# Altium schematic sheet Sch_pwr_brd_pwr.SchDoc
size A
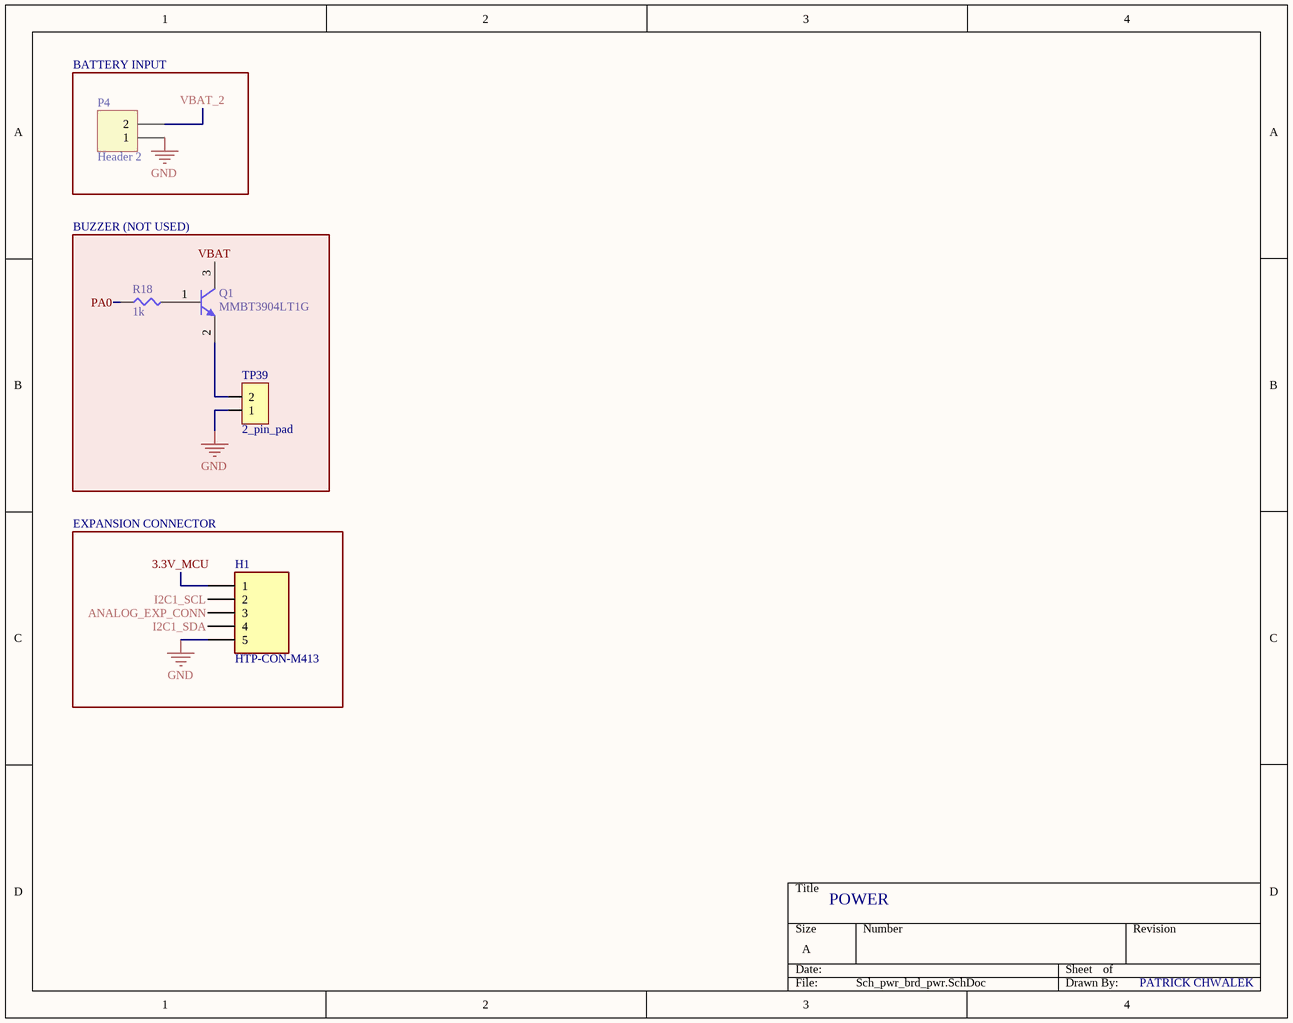
[diagram p0: Sch_pwr_brd_pwr.SchDoc]

## Parts
H1  HTP-CON-M413  [HTP-CON-M413]
P4  Header 2  [HDR1X2]
Q1  MMBT3904LT1G  [ONSC-SOT-23-3-318-08_V]
R18  1k  [SMD-0402-RES]
TP39  2_pin_pad  [Edge Connector (2-mini)]

## Blocks framed on the sheet
BATTERY INPUT: P4
BUZZER (NOT USED): Q1 R18 TP39
EXPANSION CONNECTOR: H1

## Nets
GND: H1.5 P4.1 TP39.1
3.3V_MCU: H1.1
ANALOG_EXP_CONN: H1.3
I2C1_SCL: H1.2
I2C1_SDA: H1.4
PA0: R18.1
VBAT: Q1.3(C)
VBAT_2: P4.2
NetQ1_1: Q1.1(B) R18.2
NetQ1_2: Q1.2(E) TP39.2

## Notes on the sheet
- POWER
- PATRICK CHWALEK

## Library data of the parts
P4 = Header 2: Header, 2-Pin; LatestRevisionDate: 17-Jul-2002; LatestRevisionNote: Re-released for DXP Platform.; Publisher: Altium Limited
Q1 = CMP-1048-00631-1: General Purpose Transistor, NPN Silicon, 3-Pin SOT-23, Pb-Free, Tape and Reel; Manufacturer: On Semiconductor; IC Continuous (A): 0.2; fT Min (MHz): 300; ComponentLink2Description: Datasheet; Polarity: NPN; PackageDescription: 3-Pin Small Outline Transistor, Body 2.92 x 1.3 mm, Pitch 0.95 mm; ComponentLink2URL: http://www.onsemi.cn/pub_link/Collateral/MMBT3904LT1-D.PDF; DatasheetVersion: Rev. 12; Mounting Technology: Surface Mount; PartNumber: MMBT3904LT1G; ComponentLink1URL: http://www.onsemi.com/; ComponentLink3Description: Package Specification; ComponentLink1Description: Manufacturer URL; PackageVersion: Rev. AP, 11/2009; PackageReference: SOT-23-3-318-08; Packing: Tape and Reel; ComponentLink3URL: http://www.onsemi.cn/pub_link/Collateral/318-08.PDF; RoHS: TRUE
R18 = ERJ-2GEJ102X: RES SMD 1K OHM 5% 1/10W 0402; Manufacturer: Panasonic Electronic Components; Factory Stock: 0; Unit Price (USD): 0.00350; @ qty: 1500; Minimum Quantity: 1; Power (Watts): 0.1W, 1/10W; Temperature Coefficient: ±200ppm/°C; Part Number: ERJ-2GEJ102X; Datasheets: http://industrial.panasonic.com/www-cgi/jvcr13pz.cgi?E+PZ+3+AOA0001+ERJ2GEJ102X+7+WW; Image: //media.digikey.com/Photos/Panasonic%20Photos/ERJ-PA2-Series.jpg; Digi-Key Part Number: P1.0KJCT-ND; Quantity Available: 1939857; Packaging: Cut Tape (CT); Series: ERJ; Part Status: Active; Value: 1k; Tolerance: ±5%; Composition: Thick Film; Features: Automotive AEC-Q200; Operating Temperature: -55°C ~ 155°C; Package / Case: 0402 (1005 Metric); Supplier Device Package: 0402; Size / Dimension: 0.039" L x 0.020" W (1.00mm x 0.50mm); Height - Seated (Max): 0.016" (0.40mm); Number of Terminations: 2; Failure Rate: -